# EasyEDA Pro project EasyEDAproject_AngstromIO_Mini_Devboard_2026-03-15.epro, schematic Schematic1
Board Name: Board1; Create Date: 2026-01-31; Page Name: Schematic 3 boards; Project Name: Mini Devboard; Schematic Name: Schematic1; Update Date: 2026-03-15; Company: EasyEDA.com; Page Size: A4; Version: V1.0
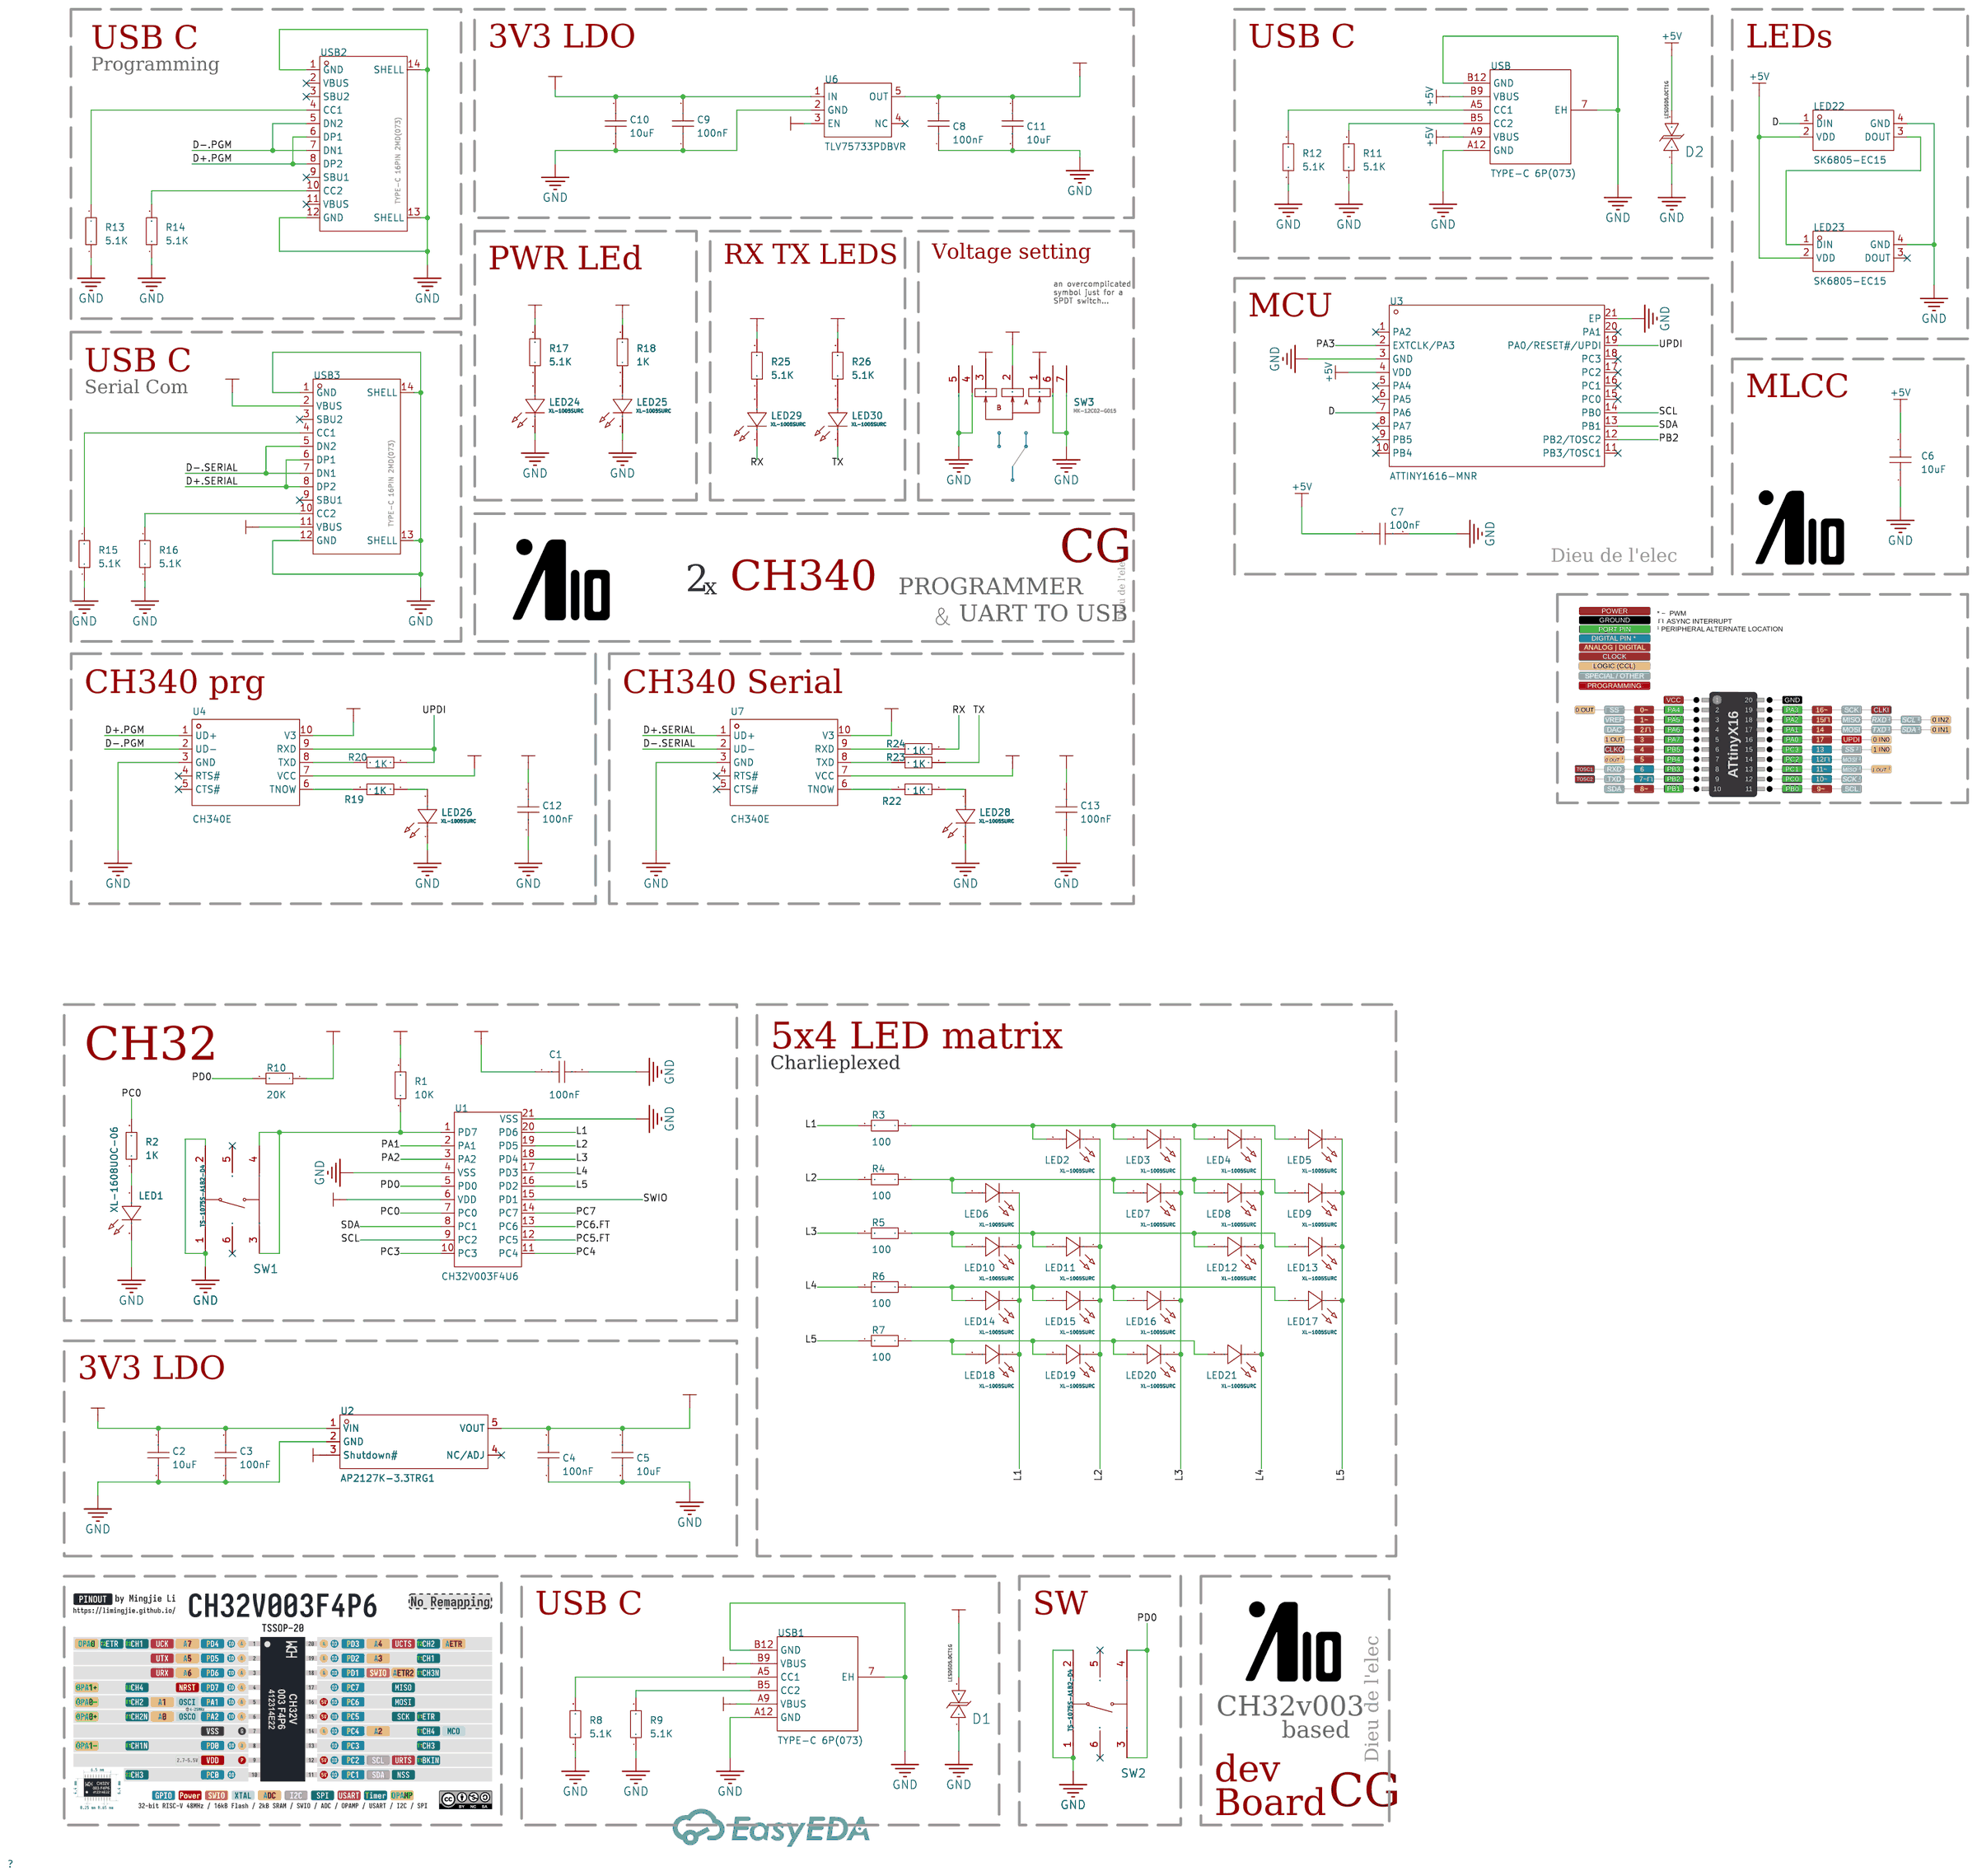
[diagram p0: schematic sheet]

## Parts
C1  100nF  [0603 CAP clean]
C2  10uF  [C0805]
C3  100nF  [0603 CAP clean]
C4  100nF  [0603 CAP clean]
C5  10uF  [C0805]
C6  10uF  [C0402]
C7  100nF  [C0402]
C8  100nF  [0603 CAP clean]
C9  100nF  [0603 CAP clean]
C10  10uF  [C0805]
C11  10uF  [C0805]
C12  100nF  [0603 CAP clean]
C13  100nF  [0603 CAP clean]
D1  LESD5D5.0CT1G  [SOD-523_L1.2-W0.8-LS1.6-BI]
D2  LESD5D5.0CT1G  [SOD-523_L1.2-W0.8-LS1.6-BI]
LED1  XL-1608UOC-06  [Dice  0603 LED BLANK]
LED2  XL-1005SURC  [LED0402]
LED3  XL-1005SURC  [LED0402]
LED4  XL-1005SURC  [LED0402]
LED5  XL-1005SURC  [LED0402]
LED6  XL-1005SURC  [LED0402]
LED7  XL-1005SURC  [LED0402]
LED8  XL-1005SURC  [LED0402]
LED9  XL-1005SURC  [LED0402]
LED10  XL-1005SURC  [LED0402]
LED11  XL-1005SURC  [LED0402]
LED12  XL-1005SURC  [LED0402]
LED13  XL-1005SURC  [LED0402]
LED14  XL-1005SURC  [LED0402]
LED15  XL-1005SURC  [LED0402]
LED16  XL-1005SURC  [LED0402]
LED17  XL-1005SURC  [LED0402]
LED18  XL-1005SURC  [LED0402]
LED19  XL-1005SURC  [LED0402]
LED20  XL-1005SURC  [LED0402]
LED21  XL-1005SURC  [LED0402]
LED22  SK6805-EC15  [LED-SMD_4P-L1.5-W1.5-BL]
LED23  SK6805-EC15  [LED-SMD_4P-L1.5-W1.5-BL]
LED24  XL-1005SURC  [LED0402]
LED25  XL-1005SURC  [LED0402]
LED26  XL-1005SURC  [LED0402]
LED28  XL-1005SURC  [LED0402]
LED29  XL-1005SURC  [LED0402]
LED30  XL-1005SURC  [LED0402]
R1  10K  [R0402]
R2  1K  [R0402]
R3  100  [R0402]
R4  100  [R0402]
R5  100  [R0402]
R6  100  [R0402]
R7  100  [R0402]
R8  5.1K  [R0402]
R9  5.1K  [R0402]
R10  20K  [R0402]
R11  5.1K  [thinner 0402]
R12  5.1K  [thinner 0402]
R13  5.1K  [thinner 0402]
R14  5.1K  [thinner 0402]
R15  5.1K  [thinner 0402]
R16  5.1K  [thinner 0402]
R17  5.1K  [thinner 0402]
R18  1K  [thinner 0402]
R19  1K  [thinner 0402]
R20  1K  [thinner 0402]
R22  1K  [thinner 0402]
R23  1K  [thinner 0402]
R24  1K  [thinner 0402]
R25  5.1K  [thinner 0402]
R26  5.1K  [thinner 0402]
SW1  TS-1075S-A1B2-D4  [Btn clean]
SW2  TS-1075S-A1B2-D4  [Btn clean]
SW3  MK-12C02-G015  [SW-SMD_G-SWITCH_MK-12C02-G015]
U1  CH32V003F4U6  [QFN-20_L3.0-W3.0-P0.40-TL-EP1.7]
U2  AP2127K-3.3TRG1  [SOT-23-5_L3.0-W1.7-P0.95-LS2.8-BR]
U3  ATTINY1616-MNR  [QFN-20_L3.0-W3.0-P0.40-BL-EP1.7]
U4  CH340E  [MSOP-10_L3.0-W3.0-P0.50-LS5.0-BL]
U6  TLV75733PDBVR  [SOT-23-5_L2.9-W1.6-P0.95-LS2.8-BL]
U7  CH340E  [MSOP-10_L3.0-W3.0-P0.50-LS5.0-BL]
USB  TYPE-C 6P(073)  [USB C one pad removed]
USB1  TYPE-C 6P(073)  [TYPE-C-SMD_TYPE-C-6P-073]
USB2  TYPE-C 16PIN 2MD(073)  [USB-C-SMD_TYPE-C-6PIN-2MD-073]
USB3  TYPE-C 16PIN 2MD(073)  [USB-C-SMD_TYPE-C-6PIN-2MD-073]

## Library data of the parts
C1 C3 C4 C8 C9 C12 C13 = CL10B104KO8NNNC: Capacitance:100nF Tolerance:±10% Tolerance:±10% Voltage Rating:16V Temperature Coefficient:X7R; LCSC Part Name: 100nF ±10% 16V; Supplier Part: C66501; Manufacturer: SAMSUNG(三星); Supplier Footprint: 0603; JLCPCB Part Class: Extended Part; Datasheet: https://item.szlcsc.com/datasheet/CL10B104KO8NNNC/67585.html; Supplier: LCSC; Tolerance: ±10%; Voltage Rating: 16V; Temperature Coefficient: X7R
C2 C5 C10 C11 = CAP_0805: Supplier Footprint: 0805
C6 = CL05A106MP5NUNC_C315248: Capacitance:10uF Tolerance:±20% Tolerance:±20% Voltage Rating:10V Temperature Coefficient:X5R; LCSC Part Name: 10uF ±20% 10V; Supplier Part: C315248; Manufacturer: SAMSUNG(三星); Manufacturer Part: CL05A106MP5NUNC; Supplier Footprint: 0402; JLCPCB Part Class: Extended Part; Datasheet: https://item.szlcsc.com/datasheet/CL05A106MP5NUNC/297154.html; Supplier: LCSC; Tolerance: ±20%; Voltage Rating: 10V; Temperature Coefficient: X5R
C7 = CL05B104KO5NNNC: Capacitance:100nF Tolerance:±10% Tolerance:±10% Voltage Rating:16V Temperature Coefficient:X7R; LCSC Part Name: 100nF ±10% 16V; Supplier Part: C1525; Manufacturer: SAMSUNG(三星); Supplier Footprint: 0402; JLCPCB Part Class: Basic Part; Datasheet: https://item.szlcsc.com/datasheet/CL05B104KO5NNNC/1877.html; Supplier: LCSC; Tolerance: ±10%; Voltage Rating: 16V; Temperature Coefficient: X7R
D1 D2 = LESD5D5.0CT1G_C5199850: Supplier Part: C5199850; Manufacturer: UMW(友台半导体); Supplier Footprint: SOD-523; JLCPCB Part Class: Extended Part; Datasheet: https://atta.szlcsc.com/upload/public/pdf/source/20231109/3A3F4A5EA6FBA8B622F70BA286F4E0C0.pdf; Supplier: LCSC
LED1 = XL-1608UOC-06: Illumination Color:Orange Voltage - Forward(Vf):2.3V Voltage - Forward(Vf):2.3V Power(Watts):50mW Forward Current:20mA Wavelength - Dominant:600nm~610nm Wavelength - Dominant:600nm~610nm Peak Wavelength:605nm Lens Color:Colorless Transparent Lens Color Te; Supplier Part: C965800; Manufacturer: XINGLIGHT(成兴光); Supplier Footprint: 0603; JLCPCB Part Class: Extended Part; Datasheet: https://item.szlcsc.com/datasheet/XL-1608UOC-06/1051409.html; Supplier: LCSC; Illumination Color: Orange; Voltage - Forward(Vf): 2.3V; Power(Watts): 50mW; Forward Current: 20mA; Wavelength - Dominant: 600nm~610nm; Peak Wavelength: 605nm; Lens Color: Colorless Transparent Lens; Luminous Intensity: 315mcd; Viewing Angle: 120°; Mounting Sytle: Positive Stick; Operating Temperature: -20℃~+85℃
LED2-LED21 LED24-LED26 LED28-LED30 = XL-1005SURC_C25503345: Illumination Color:Red Voltage - Forward(Vf):1.8V~2.4V Voltage - Forward(Vf):1.8V~2.4V Power(Watts):50mW Forward Current:20mA Wavelength - Dominant:615nm~630nm Wavelength - Dominant:615nm~630nm Peak Wavelength:625nm Luminous Intensity:200mcd Luminous Inte; LCSC Part Name: 0402分光红贴片式发光二极管; Supplier Part: C25503345; Manufacturer: XINGLIGHT(成兴光); Supplier Footprint: 0402; JLCPCB Part Class: Extended Part; Datasheet: https://item.szlcsc.com/datasheet/XL-1005SURC/27234956.html; Supplier: LCSC; Illumination Color: Red; Voltage - Forward(Vf): 1.8V~2.4V; Power(Watts): 50mW; Forward Current: 20mA; Wavelength - Dominant: 615nm~630nm; Peak Wavelength: 625nm; Luminous Intensity: 200mcd; Viewing Angle: 120°; Operating Temperature: -40℃~+85℃
LED22 LED23 = SK6805-EC15: Wavelength:620nm~625nm；460nm~470nm；520nm~530nm Luminous Intensity:R:50mcd~100mcd；B:20mcd~40mcd；G:120mcd~240mcd Fixed-Frequency Pwm Mode:1kHz Data Transmission Rate:800Kbit/s Voltage - Supply:3.5V~5.5V Voltage - Supply:3.5V~5.5V Quiescent Current:0.5mA Len; LCSC Part Name: RGB三色; Supplier Part: C2890035; Manufacturer: 欧思科光电; Supplier Footprint: SMD-4P,1.5x1.5mm; JLCPCB Part Class: Extended Part; Datasheet: https://item.szlcsc.com/datasheet/SK6805-EC15/3113214.html; Supplier: LCSC; Wavelength: 620nm~625nm；460nm~470nm；520nm~530nm; Luminous Intensity: R:50mcd~100mcd；B:20mcd~40mcd；G:120mcd~240mcd; Fixed-Frequency Pwm Mode: 1kHz; Data Transmission Rate: 800Kbit/s; Voltage - Supply: 3.5V~5.5V; Quiescent Current: 0.5mA; Lens Color: Semi-transparent lens; ESD Withstand Voltage: 2000V; Operating Temperature: -40℃~+80℃; Viewing Angle: 160°; Length: 1.5mm; Width: 0.65mm; Height: 1.5mm
R1-R20 R22-R26 = Res_0402: Supplier Footprint: 0402
SW1 SW2 = TS-1075S-A1B2-D4: Circuit:SPST Actuator Style:Round Button Operating Force:1.8N Mounting Type:- Length:3.1mm Width:3.1mm Switch Height:1.5mm With Lamp:- Life:-; LCSC Part Name: 轻触开关3.0*3.0*1.5mm黑柄正按四脚贴片180gf; Supplier Part: C492872; Manufacturer: Yuandi(元迪); JLCPCB Part Class: Extended Part; Datasheet: https://item.szlcsc.com/datasheet/TS-1075S-A1B2-D4/503552.html; Supplier: LCSC; Circuit: SPST; Actuator Style: Round Button; Operating Force: 1.8N; Length: 3.1mm; Width: 3.1mm; Switch Height: 1.5mm
SW3 = MK-12C02-G015_C2911519: Circuit:SPDT Actuator Style:Rectangular Columnar Termination Style:- Length:6.6mm Width:1.4mm Switch Height:4.2mm Mounting Type:Surface Mount, Right Angle Actuator Color:Black Current Rating:1A Voltage Rating:6V Life:10,000 Cycles Operating Temperature:-2; LCSC Part Name: 七脚贴片微型拨动开关 G1.5; Supplier Part: C2911519; Manufacturer: G-Switch(品赞); Supplier Footprint: SMD,6.6x1.4mm; JLCPCB Part Class: Extended Part; Datasheet: https://item.szlcsc.com/datasheet/MK-12C02-G015/3191561.html; Supplier: LCSC; Circuit: SPDT; Actuator Style: Rectangular Columnar; Length: 6.6mm; Width: 1.4mm; Switch Height: 4.2mm; Mounting Type: Surface Mount, Right Angle; Actuator Color: Black; Current Rating: 1A; Voltage Rating: 6V; Life: 10,000 Cycles; Operating Temperature: -20℃~+70℃
U1 = CH32V003F4U6: CPU Core:RISC-V CPU Maximum Speed:48MHz Program Storage Size:16KB Number of I/O:18 Applications:-; LCSC Part Name: QingKe V2微处理器; Supplier Part: C5299908; Manufacturer: WCH(南京沁恒); Supplier Footprint: QFN-20(3X3); JLCPCB Part Class: Extended Part; Datasheet: https://item.szlcsc.com/datasheet/CH32V003F4U6/6049934.html; Supplier: LCSC; CPU Core: RISC-V; CPU Maximum Speed: 48MHz; Program Storage Size: 16KB; Number of I/O: 18
U2 = AP2127K-3.3TRG1: Output Type:Fixed Voltage - Supply:6V Output Voltage:3.3V Output Voltage:3.3V Output Current:300mA Power Supply Rejection Ratio (PSRR):68dB@(1kHz) Voltage Dropout:170mV@(300mA) standby current:60uA Noise:60uVrms Features:Over Current Protection；Enable；Ove; LCSC Part Name: 输入6V 输出3.3V 300mA; Supplier Part: C156285; Manufacturer: DIODES(美台); Supplier Footprint: SOT-23-5; JLCPCB Part Class: Extended Part; Datasheet: https://item.szlcsc.com/datasheet/AP2127K-3.3TRG1/167628.html; Supplier: LCSC; Output Type: Fixed; Voltage - Supply: 6V; Output Voltage: 3.3V; Output Current: 300mA; Power Supply Rejection Ratio (PSRR): 68dB@(1kHz); Voltage Dropout: 170mV@(300mA); standby current: 60uA; Noise: 60uVrms; Features: Over Current Protection；Enable；Over Temperature Protection; Operating Temperature: -40℃~+85℃@(Ta); Output Configuration: Positive; Number of Outputs: 1
U3 = ATTINY1616-MNR: CPU Core:AVR CPU Maximum Speed:20MHz Program Storage Size:16KB Program Memory Type:FLASH Number of I/O:18 ADC (Bit):10bit DAC (Bit):8bit Voltage - Supply:1.8V~5.5V Voltage - Supply:1.8V~5.5V Applications:-; LCSC Part Name: tinyAVR 1系列处理器; Supplier Part: C507118; Manufacturer: MICROCHIP(美国微芯); Supplier Footprint: QFN-20-EP(3x3); JLCPCB Part Class: Extended Part; Datasheet: https://item.szlcsc.com/datasheet/ATTINY1616-MNR/520766.html; Supplier: LCSC; CPU Core: AVR; CPU Maximum Speed: 20MHz; Program Storage Size: 16KB; Program Memory Type: FLASH; Number of I/O: 18; ADC (Bit): 10bit; DAC (Bit): 8bit; Voltage - Supply: 1.8V~5.5V
U4 U7 = CH340E: Applications Function:Transceiver USB Protocol:USB 2.0 Voltage - Supply:3.3V；5V Voltage - Supply:3.3V；5V Data Rate:2Mbps Current - Supply:20mA Supply Current (Iq):150uA; LCSC Part Name: USB转串口芯片CH340; Supplier Part: C99652; Manufacturer: WCH(南京沁恒); Supplier Footprint: MSOP-10; JLCPCB Part Class: Extended Part; Datasheet: https://item.szlcsc.com/datasheet/CH340E/100866.html; Supplier: LCSC; Applications Function: Transceiver; USB Protocol: USB 2.0; Voltage - Supply: 3.3V；5V; Data Rate: 2Mbps; Current - Supply: 20mA; Supply Current (Iq): 150uA
U6 = TLV75733PDBVR: Output Type:Fixed Voltage - Supply:5.5V Output Voltage:3.3V Output Voltage:3.3V Output Current:1A Power Supply Rejection Ratio (PSRR):46dB@(100kHz) Voltage Dropout:650mV@(1A) standby current:40uA Noise:71.5uVrms Features:Under Voltage Lockout；Soft Start；O; LCSC Part Name: 具有使能功能的 1A、低 IQ、高精度、低压降稳压器; Supplier Part: C485517; Manufacturer: TI(德州仪器); Supplier Footprint: SOT-23-5; JLCPCB Part Class: Extended Part; Datasheet: https://www.ti.com/cn/lit/gpn/tlv757p; Supplier: LCSC; Output Type: Fixed; Voltage - Supply: 5.5V; Output Voltage: 3.3V; Output Current: 1A; Power Supply Rejection Ratio (PSRR): 46dB@(100kHz); Voltage Dropout: 650mV@(1A); standby current: 40uA; Noise: 71.5uVrms; Features: Under Voltage Lockout；Soft Start；Over Temperature Protection；Over Current Protection; Operating Temperature: -40℃~+125℃@(Tj); Output Configuration: Positive; Number of Outputs: 1
USB USB1 = TYPE-C 6P(073): Connector Type:Type-C Protocol Standard:- Gender:Female Mounting Type:Surface Mount, Right Angle Number of Contacts:6P Number of Ports:1 Current Rating-Power:3A Voltage Rating:5V Connect-Disconnect Life:10,000 Cycles Supplementary Features:- Center Height; LCSC Part Name: 6P卧贴母座; Supplier Part: C668623; Manufacturer: SHOU HAN(首韩); Supplier Footprint: SMD; JLCPCB Part Class: Extended Part; Datasheet: https://item.szlcsc.com/datasheet/TYPE-C%25206P(073)/698566.html; Supplier: LCSC; Connector Type: Type-C; Gender: Female; Mounting Type: Surface Mount, Right Angle; Number of Contacts: 6P; Number of Ports: 1; Current Rating-Power: 3A; Voltage Rating: 5V; Connect-Disconnect Life: 10,000 Cycles; Detection color: Black; Operating Temperature: -25℃~+85℃
USB2 USB3 = TYPE-C 16PIN 2MD(073): Connector Type:Type-C Protocol Standard:- Gender:Female Mounting Type:Surface Mount, Right Angle Number of Contacts:16P Number of Ports:1 Current Rating-Power:3A Voltage Rating:5V Connect-Disconnect Life:5,000 times Supplementary Features:- Center Height:; LCSC Part Name: 16P卧贴母座; Supplier Part: C2765186; Manufacturer: SHOU HAN(首韩); Supplier Footprint: SMD; JLCPCB Part Class: Extended Part; Datasheet: https://item.szlcsc.com/datasheet/TYPE-C%252016PIN%25202MD(073)/2901843.html; Supplier: LCSC; Connector Type: Type-C; Gender: Female; Mounting Type: Surface Mount, Right Angle; Number of Contacts: 16P; Number of Ports: 1; Current Rating-Power: 3A; Voltage Rating: 5V; Connect-Disconnect Life: 5,000 times; Detection color: Black; Operating Temperature: -25℃~+85℃

## Nets
+3.3V: C1.1 C4.2 C5.1 C8.2 C11.1 R1.2 R10.1 R18.2 R25.2 R26.2 SW3.1 U1.6(VDD) U2.5(VOUT) U4.10(V3) U6.5(OUT) U7.10(V3)
+5V: C6.2 C7.1 D2.2 LED22.2(VDD) LED23.2(VDD) U3.4(VDD) USB.A9(VBUS) USB.B9(VBUS)
GND: C1.2 C2.2 C3.1 C4.1 C5.2 C6.1 C7.2 C8.1 C9.1 C10.2 C11.2 C12.1 C13.1 D1.1 D2.1 LED1.2(A) LED22.4(GND) LED23.4(GND) LED24.1(K) LED25.1(K) LED26.1(K) LED28.1(K) R8.1 R9.1 R11.1 R12.1 R13.1 R14.1 R15.1 R16.1 SW1.1 SW1.2 SW2.1 SW2.2 SW3.4 SW3.5 SW3.6 SW3.7 U1.4(VSS) U1.21(VSS) U2.2(GND) U3.3(GND) U3.21(EP) U4.3(GND) U6.2(GND) U7.3(GND) USB.7(EH) USB.A12(GND) USB.B12(GND) USB1.7(EH) USB1.A12(GND) USB1.B12(GND) USB2.1(GND) USB2.12(GND) USB2.13(SHELL) USB2.14(SHELL) USB3.1(GND) USB3.12(GND) USB3.13(SHELL) USB3.14(SHELL)
VBUS: C9.2 C10.1 R17.2 SW3.3 U6.1(IN) U6.3(EN) USB3.2(VBUS) USB3.11(VBUS)
VDD.P: C12.2 C13.2 SW3.2 U4.7(VCC) U7.7(VCC)
VIN: C2.1 C3.2 D1.2 U2.1(VIN) U2.3(Shutdown#) USB1.A9(VBUS) USB1.B9(VBUS)
D: LED22.1(DIN) U3.7(PA6)
D+.PGM: U4.1(UD+) USB2.6(DP1) USB2.8(DP2)
D+.SERIAL: U7.1(UD+) USB3.6(DP1) USB3.8(DP2)
D-.PGM: U4.2(UD-) USB2.5(DN2) USB2.7(DN1)
D-.SERIAL: U7.2(UD-) USB3.5(DN2) USB3.7(DN1)
L1: LED6.1(K) LED10.1(K) LED14.1(K) LED18.1(K) R3.2 U1.20(PD6)
L2: LED2.1(K) LED11.1(K) LED15.1(K) LED19.1(K) R4.2 U1.19(PD5)
L3: LED3.1(K) LED7.1(K) LED16.1(K) LED20.1(K) R5.2 U1.18(PD4)
L4: LED4.1(K) LED8.1(K) LED12.1(K) LED21.1(K) R6.2 U1.17(PD3)
L5: LED5.1(K) LED9.1(K) LED13.1(K) LED17.1(K) R7.2 U1.16(PD2)
PA1: U1.2(PA1)
PA2: U1.3(PA2)
PA3: U3.2(EXTCLK/PA3)
PB2: U3.12(PB2/TOSC2)
PC0: R2.2 U1.7(PC0)
PC3: U1.10(PC3)
PC4: U1.11(PC4)
PC5.FT: U1.12(PC5)
PC6.FT: U1.13(PC6)
PC7: U1.14(PC7)
PD0: R10.2 SW2.3 SW2.4 U1.5(PD0)
RX: LED29.1(K) R24.1
SCL: U1.9(PC2) U3.14(PB0)
SDA: U1.8(PC1) U3.13(PB1)
SWIO: U1.15(PD1)
TX: LED30.1(K) R23.1
UPDI: R20.1 U3.19(PA0/RESET#/UPDI) U4.9(RXD)
$1N428: LED1.1(K) R2.1
$1N967: R1.1 SW1.3 SW1.4 U1.1(PD7)
$1N1600: LED2.2(A) LED3.2(A) LED4.2(A) LED5.2(A) R3.1
$1N2357: LED6.2(A) LED7.2(A) LED8.2(A) LED9.2(A) R4.1
$1N2614: LED10.2(A) LED11.2(A) LED12.2(A) LED13.2(A) R5.1
$1N3015: LED14.2(A) LED15.2(A) LED16.2(A) LED17.2(A) R6.1
$1N3272: LED18.2(A) LED19.2(A) LED20.2(A) LED21.2(A) R7.1
$1N4160: R9.2 USB1.B5(CC2)
$1N4165: R8.2 USB1.A5(CC1)
$1N8336: R12.2 USB.A5(CC1)
$1N8340: R11.2 USB.B5(CC2)
$1N8511: LED22.3(DOUT) LED23.1(DIN)
$1N16182: R13.2 USB2.4(CC1)
$1N16183: R14.2 USB2.10(CC2)
$1N17922: R16.2 USB3.10(CC2)
$1N17923: R15.2 USB3.4(CC1)
$1N18529: LED24.2(A) R17.1
$1N18636: LED25.2(A) R18.1
$1N18732: R19.2 U4.6(TNOW)
$1N18734: LED26.2(A) R19.1
$1N19203: R20.2 U4.8(TXD)
$1N21642: LED28.2(A) R22.1
$1N21643: R22.2 U7.6(TNOW)
$1N21653: R23.2 U7.8(TXD)
$1N21686: R24.2 U7.9(RXD)
$1N21796: LED29.2(A) R25.1
$1N21889: LED30.2(A) R26.1

Not connected (* = marked no-connect by the designer): LED23 3(DOUT)*; SW1 5* 6*; SW2 5* 6*; U2 4(NC/ADJ)*; U3 1(PA2)* 5(PA4)* 6(PA5)* 8(PA7)* 9(PB5)* 10(PB4)* 11(PB3/TOSC1)* 15(PC0)* 16(PC1)* 17(PC2)* 18(PC3)* 20(PA1)*; U4 4(RTS#)* 5(CTS#)*; U6 4(NC)*; U7 4(RTS#)* 5(CTS#)*; USB2 2(VBUS)* 3(SBU2)* 9(SBU1)* 11(VBUS)*; USB3 3(SBU2)* 9(SBU1)*

## Notes on the sheet
- USB C
- 3V3 LDO
- USB C
- LEDs
- Programming
- Voltage setting
- PWR LEd
- RX TX LEDS
- an overcomplicated
  symbol just for a
  SPDT switch...
- MCU
- USB C
- Serial Com
- MLCC
- Dieu de l'elec
- CG
- 2
- x
- CH340
- PROGRAMMER
- &
- UART TO USB
- Dieu de l'elec
- CH340 prg
- CH340 Serial
- 5x4 LED matrix
- CH32
- Charlieplexed
- 3V3 LDO
- USB C
- SW
- CH32v003
- based
- Dieu de l'elec
- dev
- Board
- CG
